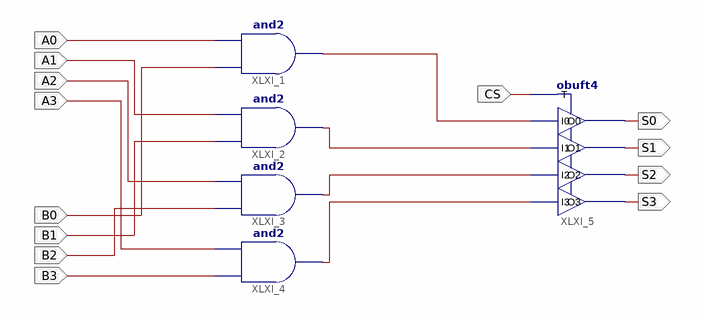
[diagram p0: schematic sheet 1]
// Xilinx ISE schematic AndX4.sch (spartan3e) as structural Verilog: 5 symbols, 13 ports
module AndX4 (
  input  A0,
  input  B0,
  input  A1,
  input  B1,
  input  A2,
  input  B2,
  input  A3,
  input  B3,
  input  CS,
  output S0,
  output S1,
  output S2,
  output S3
);

  wire XLXN_2, XLXN_3, XLXN_4, XLXN_5;

  and XLXI_1 (XLXN_2, B0, A0);
  and XLXI_2 (XLXN_3, B1, A1);
  and XLXI_3 (XLXN_4, B2, A2);
  and XLXI_4 (XLXN_5, B3, A3);
  obuft4 XLXI_5 (.I0(XLXN_2), .I1(XLXN_3), .I2(XLXN_4), .I3(XLXN_5), .T(CS), .O0(S0), .O1(S1), .O2(S2), .O3(S3));
endmodule
